# EAGLE design CBB-XBEE-r02_update (EAGLE 7.6.0)
DATABASE: ./../BOM/logic-supply-db.txt
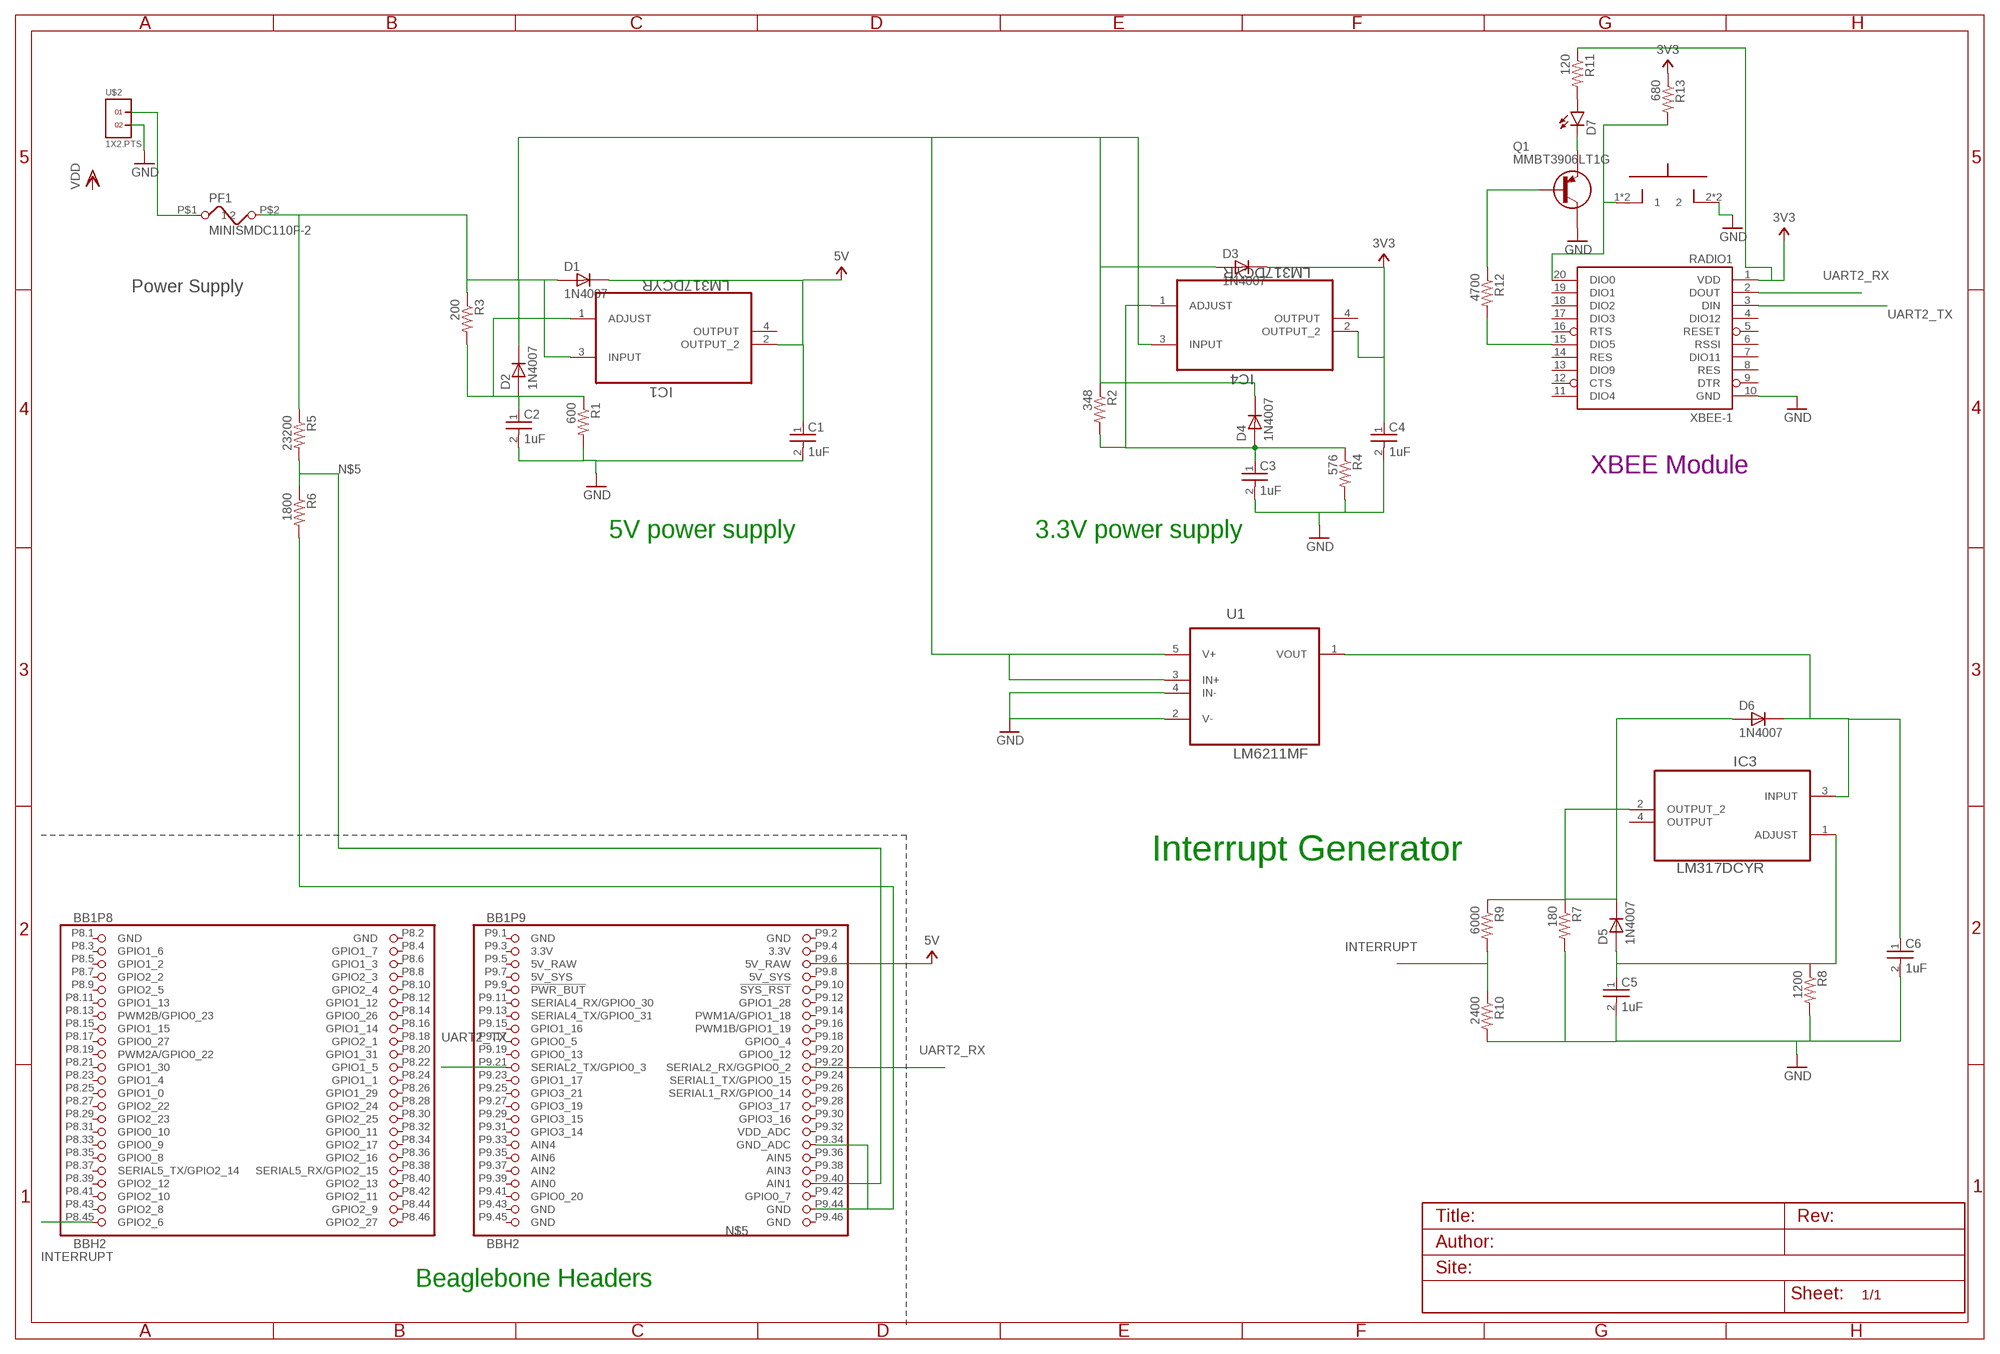
[diagram p0: schematic, sheet 1]

## Parts
BB1  BBH2  [BB_CAPE_TOP]
C1  1uF  GRM21BR71C105KA01L  [CAPC2012X135N]
C2  1uF  GRM21BR71C105KA01L  [CAPC2012X135N]
C3  1uF  GRM21BR71C105KA01L  [CAPC2012X135N]
C4  1uF  GRM21BR71C105KA01L  [CAPC2012X135N]
C5  1uF  GRM21BR71C105KA01L  [CAPC2012X135N]
C6  1uF  GRM21BR71C105KA01L  [CAPC2012X135N]
D1  1N4007  [DIOAD1070W78L465D235P]
D2  1N4007  [DIOAD1070W78L465D235P]
D3  1N4007  [DIOAD1070W78L465D235P]
D4  1N4007  [DIOAD1070W78L465D235P]
D5  1N4007  [DIOAD1070W78L465D235P]
D6  1N4007  [DIOAD1070W78L465D235P]
D7  LED3MM  [LED3MM]
IC1  LM317DCYR  [SOT230P700X180-4N]
IC3  LM317DCYR  [SOT230P700X180-4N]
IC4  LM317DCYR  [SOT230P700X180-4N]
PF1  MINISMDC110F-2  [MINISMDC110]
Q1  MMBT3906LT1G  [SOT23]
R1  600  RESISTOR0603  [0603-RES]
R2  348  RESISTOR0603  [0603-RES]
R3  200  RESISTOR0603  [0603-RES]
R4  576  RESISTOR0603  [0603-RES]
R5  23200  RESISTOR0603  [0603-RES]
R6  1800  RESISTOR0603  [0603-RES]
R7  180  RESISTOR0603  [0603-RES]
R8  1200  RESISTOR0603  [0603-RES]
R9  6000  RESISTOR0603  [0603-RES]
R10  2400  RESISTOR0603  [0603-RES]
R11  120  RESISTOR0603  [0603-RES]
R12  4700  RESISTOR0603  [0603-RES]
R13  680  RESISTOR0603  [0603-RES]
RADIO1  XBEE-1  [XBEE]
U1  LM6211MF  [SOT95P284X122-5N]
U$1  SPST-NOKS-01Q-01  [KS-01Q-01]
U$2  1X2.PTS  [PTS.FIXED]

## Nets
3V3: C4.1(A) D3.C IC4.2(OUTPUT_2) R11.1 R13.1 RADIO1.1(VDD)
5V: BB1.P9.6(P9:5V_RAW) C1.1(A) D1.C IC1.2(OUTPUT_2)
GND: C1.2(C) C2.2(C) C3.2(C) C4.2(C) C5.2(C) C6.2(C) Q1.3(C) R1.2 R4.2 R7.2 R8.2 R10.2 RADIO1.10(GND) U1.2(V-) U1.4(IN-) U$1.2 U$1.4 U$2.2
INTERRUPT: BB1.P8.45(P8:GPIO2_6) R9.2 R10.1
N$2: C3.1(A) D4.A IC4.1(ADJUST) R2.2 R4.1
N$3: D5.C D6.A IC3.2(OUTPUT_2) R7.1 R9.1
N$4: C2.1(A) D2.A IC1.1(ADJUST) R1.1 R3.2
N$5: BB1.P9.40(P9:AIN1) R5.2 R6.1
N$6: R12.2 RADIO1.15(DIO5)
N$7: D1.A D2.C D3.A D4.C IC1.3(INPUT) IC4.3(INPUT) PF1.P$2 R2.1 R3.1 R5.1 U1.3(IN+) U1.5(V+)
N$8: Q1.1(B) R12.1
N$9: C5.1(A) D5.A IC3.1(ADJUST) R8.1
N$10: C6.1(A) D6.C IC3.3(INPUT) U1.1(VOUT)
N$11: R13.2 RADIO1.20(DIO0) U$1.1 U$1.3
N$12: D7.A R11.2
N$13: D7.K(C) Q1.2(E)
N$14: PF1.P$1 U$2.1
N$33: BB1.P9.34(P9:GND_ADC) BB1.P9.44(P9:GND) R6.2
UART2_RX: BB1.P9.22(P9:SERIAL2_RX/GGPIO0_2) RADIO1.2(DOUT)
UART2_TX: BB1.P9.21(P9:SERIAL2_TX/GPIO0_3) RADIO1.3(DIN)
Unconnected: BB1.P8.3(P8:GPIO1_6) BB1.P8.4(P8:GPIO1_7) BB1.P8.5(P8:GPIO1_2) BB1.P8.6(P8:GPIO1_3) BB1.P8.7(P8:GPIO2_2) BB1.P8.8(P8:GPIO2_3) BB1.P8.9(P8:GPIO2_5) BB1.P8.10(P8:GPIO2_4) BB1.P8.11(P8:GPIO1_13) BB1.P8.12(P8:GPIO1_12) BB1.P8.13(P8:PWM2B/GPIO0_23) BB1.P8.14(P8:GPIO0_26) BB1.P8.15(P8:GPIO1_15) BB1.P8.16(P8:GPIO1_14) BB1.P8.17(P8:GPIO0_27) BB1.P8.18(P8:GPIO2_1) BB1.P8.19(P8:PWM2A/GPIO0_22) BB1.P8.20(P8:GPIO1_31) BB1.P8.21(P8:GPIO1_30) BB1.P8.22(P8:GPIO1_5) BB1.P8.23(P8:GPIO1_4) BB1.P8.24(P8:GPIO1_1) BB1.P8.25(P8:GPIO1_0) BB1.P8.26(P8:GPIO1_29) BB1.P8.27(P8:GPIO2_22) BB1.P8.28(P8:GPIO2_24) BB1.P8.29(P8:GPIO2_23) BB1.P8.30(P8:GPIO2_25) BB1.P8.31(P8:GPIO0_10) BB1.P8.32(P8:GPIO0_11) BB1.P8.33(P8:GPIO0_9) BB1.P8.34(P8:GPIO2_17) BB1.P8.35(P8:GPIO0_8) BB1.P8.36(P8:GPIO2_16) BB1.P8.37(P8:SERIAL5_TX/GPIO2_14) BB1.P8.38(P8:SERIAL5_RX/GPIO2_15) BB1.P8.39(P8:GPIO2_12) BB1.P8.40(P8:GPIO2_13) BB1.P8.41(P8:GPIO2_10) BB1.P8.42(P8:GPIO2_11) BB1.P8.43(P8:GPIO2_8) BB1.P8.44(P8:GPIO2_9) BB1.P8.46(P8:GPIO2_27) BB1.P9.9(P9:!PWR_BUT) BB1.P9.10(P9:!SYS_RST) BB1.P9.11(P9:SERIAL4_RX/GPIO0_30) BB1.P9.12(P9:GPIO1_28) BB1.P9.13(P9:SERIAL4_TX/GPIO0_31) BB1.P9.14(P9:PWM1A/GPIO1_18) BB1.P9.15(P9:GPIO1_16) BB1.P9.16(P9:PWM1B/GPIO1_19) BB1.P9.17(P9:GPIO0_5) BB1.P9.18(P9:GPIO0_4) BB1.P9.19(P9:GPIO0_13) BB1.P9.20(P9:GPIO0_12) BB1.P9.23(P9:GPIO1_17) BB1.P9.24(P9:SERIAL1_TX/GPIO0_15) BB1.P9.25(P9:GPIO3_21) BB1.P9.26(P9:SERIAL1_RX/GPIO0_14) BB1.P9.27(P9:GPIO3_19) BB1.P9.28(P9:GPIO3_17) BB1.P9.29(P9:GPIO3_15) BB1.P9.30(P9:GPIO3_16) BB1.P9.31(P9:GPIO3_14) BB1.P9.32(P9:VDD_ADC) BB1.P9.33(P9:AIN4) BB1.P9.35(P9:AIN6) BB1.P9.36(P9:AIN5) BB1.P9.37(P9:AIN2) BB1.P9.38(P9:AIN3) BB1.P9.39(P9:AIN0) BB1.P9.41(P9:GPIO0_20) BB1.P9.42(P9:GPIO0_7) BB1.P9.43(P9:GND) BB1.P9.45(P9:GND) BB1.P9.46(P9:GND) IC1.4(OUTPUT) IC3.4(OUTPUT) IC4.4(OUTPUT) RADIO1.4(DIO12) RADIO1.5(RESET) RADIO1.6(RSSI) RADIO1.7(DIO11) RADIO1.8(RES) RADIO1.9(DTR) RADIO1.11(DIO4) RADIO1.12(CTS) RADIO1.13(DIO9) RADIO1.14(RES) RADIO1.16(RTS) RADIO1.17(DIO3) RADIO1.18(DIO2) RADIO1.19(DIO1)

## Notes on the sheet
- Power Supply
- XBEE Module
- 5V power supply | 3.3V power supply
- Interrupt Generator
- Beaglebone Headers

## Power pins joined to a net without a drawn wire
3.3V: BB1.P9.3(P9:3.3V) BB1.P9.4(P9:3.3V)
5V_RAW: BB1.P9.5(P9:5V_RAW)
5V_SYS: BB1.P9.7(P9:5V_SYS) BB1.P9.8(P9:5V_SYS)
GND: BB1.P8.1(P8:GND) BB1.P8.2(P8:GND) BB1.P9.1(P9:GND) BB1.P9.2(P9:GND)

## Library data of the parts
BB1 = logic-supply:BBH: BeagleBone header sub-assembly BBH1 outdated, use BBH2 or BBH3 only
C1-C6 = GRM21BR71C105KA01L:GRM21BR71C105KA01L: 0805 1 uF 16 V ±10% Tolerance X7R SMT Multilayer Ceramic Capacitor
D1-D6 = 1N4007:1N4007
D7 = spark_led:LED: LEDs Standard schematic elements and footprints for 5mm, 3mm, 1206, and 0603 sized LEDs. 5mm - Spark Fun Electronics SKU : COM-00529 (and others); PROD_ID: DIO-08794
IC1 IC3 IC4 = LM317DCYR:LM317DCYR: IC ADJ LINEAR REG 1.25V TO 37V
PF1 = MINISMDC110F-2:MINISMDC110F-2
Q1 = MMBT3906LT1G:MMBT3906LT1G: http://octopart.com/mmbt3906lt1g.-on+semiconductor-8986246
R1-R13 = sparkres:RESISTOR: Resistor Basic schematic elements and footprints for 0603, 1206, and PTH resistors.
RADIO1 = logic-supply:XBEE-1: Xbee module footprint Derived from SparkFun-RF.lbr
U1 = LM6211MF:LM6211MF: Operational Amplifier
U$1 = firefly:SPST-NO
U$2 = terminal:1X2

## Board
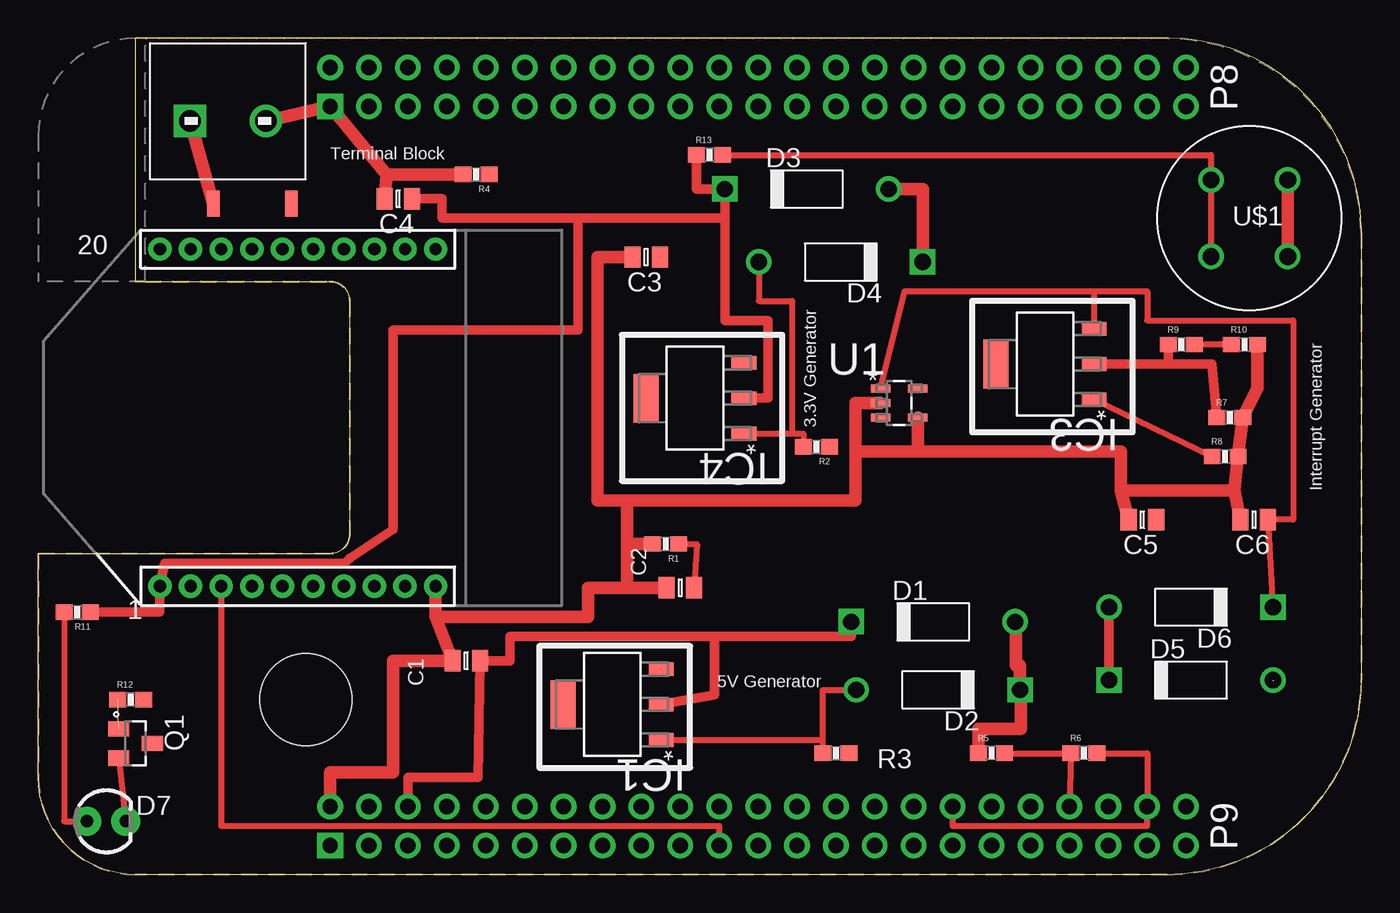
[diagram p1: board, top side]
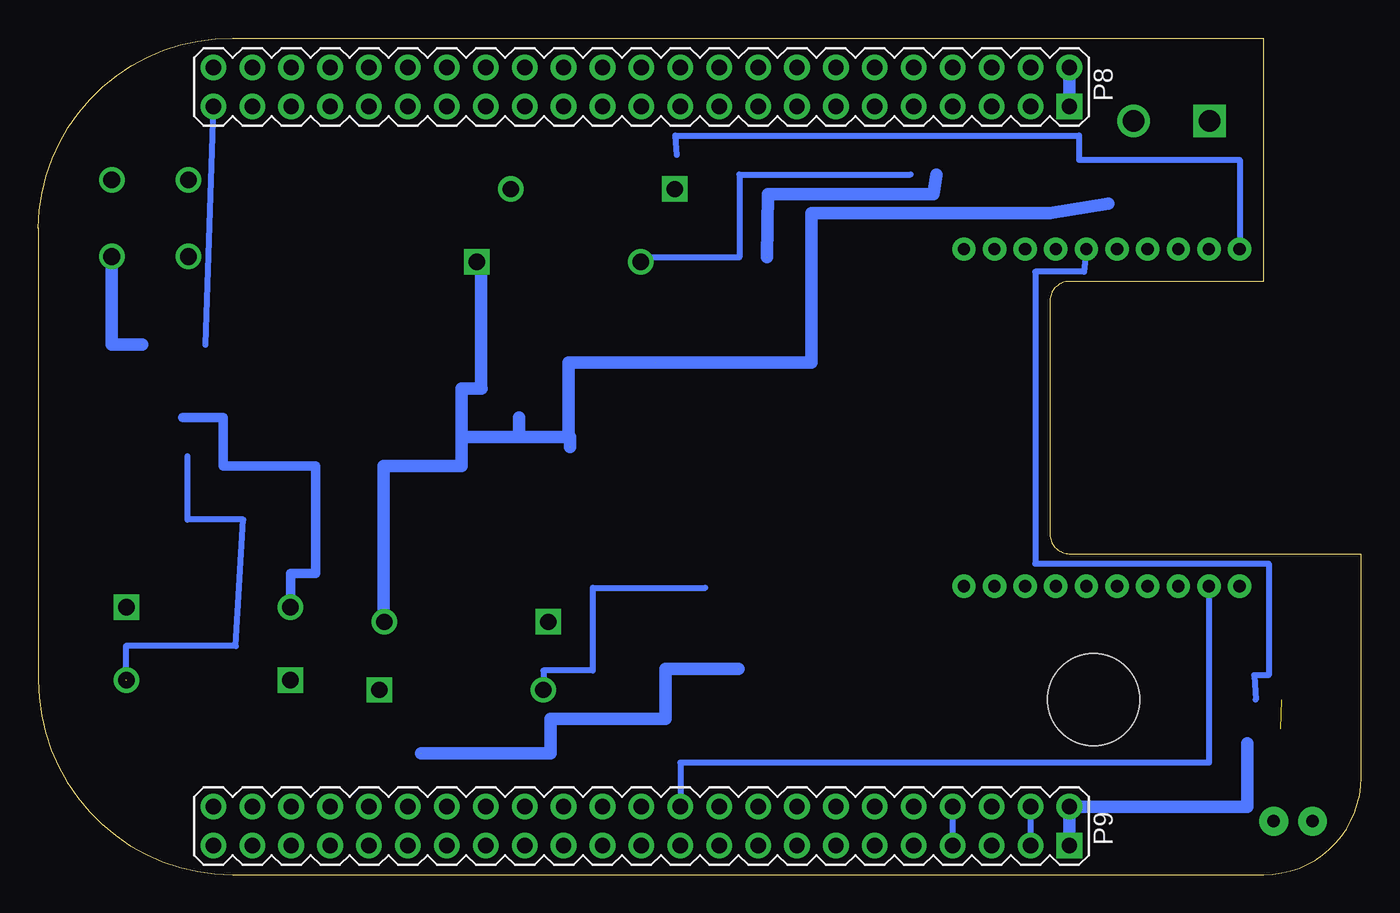
[diagram p2: board, bottom side, seen from below]

Size 86.36 x 54.61 mm. Coordinates in mm from the lower left corner, seen from the top.
Outline: 86.36,42.23 86.36,12.7 arc-90 73.66,0 6.35,0 arc-90 0,6.35 0,20.95 19.05,20.95 arc90 20.32,22.23 20.32,37.47 arc90 19.05,38.73 6.35,38.73 6.35,54.61 73.66,54.61 arc-90 86.36,42.23
Copper layers (1*16): Top 0.0356mm / dielectric 1.5011mm / Bottom 0.0356mm
Design rules "logicsupply": minimum track width 5mil, minimum drill 13mil, track to track 8mil, track to pad 8mil, pad to pad 8mil, via to via 8mil, smd to smd 8mil, copper to edge 10mil, drill to drill 6mil, minimum pad ring 7mil, minimum via ring 7mil, stop-mask expansion 4mil, vias tented up to drill 0mil, thermal gap 10mil
Holes 6 mm at 17.46,11.43

### Footprints (pad centres in the part's own frame; a part is rotated, then mirrored left to right if it is on the bottom)
BB_CAPE_TOP = drill 1 pad 1.676 square: P8.1 50.165,19.05; P9.1 1.905,19.05 | drill 1 pad 1.676: P8.2 52.705,19.05; P8.3 50.165,21.59; P8.4 52.705,21.59; P8.5 50.165,24.13; P8.6 52.705,24.13; P8.7 50.165,26.67; P8.8 52.705,26.67; P8.9 50.165,29.21; P8.10 52.705,29.21; P8.11 50.165,31.75; P8.12 52.705,31.75; P8.13 50.165,34.29; P8.14 52.705,34.29; P8.15 50.165,36.83; P8.16 52.705,36.83; P8.17 50.165,39.37; P8.18 52.705,39.37; P8.19 50.165,41.91; P8.20 52.705,41.91; P8.21 50.165,44.45; P8.22 52.705,44.45; P8.23 50.165,46.99; P8.24 52.705,46.99; P8.25 50.165,49.53; P8.26 52.705,49.53; P8.27 50.165,52.07; P8.28 52.705,52.07; P8.29 50.165,54.61; P8.30 52.705,54.61; P8.31 50.165,57.15; P8.32 52.705,57.15; P8.33 50.165,59.69; P8.34 52.705,59.69; P8.35 50.165,62.23; P8.36 52.705,62.23; P8.37 50.165,64.77; P8.38 52.705,64.77; P8.39 50.165,67.31; P8.40 52.705,67.31; P8.41 50.165,69.85; P8.42 52.705,69.85; P8.43 50.165,72.39; P8.44 52.705,72.39; P8.45 50.165,74.93; P8.46 52.705,74.93; P9.2 4.445,19.05; P9.3 1.905,21.59; P9.4 4.445,21.59; P9.5 1.905,24.13; P9.6 4.445,24.13; P9.7 1.905,26.67; P9.8 4.445,26.67; P9.9 1.905,29.21; P9.10 4.445,29.21; P9.11 1.905,31.75; P9.12 4.445,31.75; P9.13 1.905,34.29; P9.14 4.445,34.29; P9.15 1.905,36.83; P9.16 4.445,36.83; P9.17 1.905,39.37; P9.18 4.445,39.37; P9.19 1.905,41.91; P9.20 4.445,41.91; P9.21 1.905,44.45; P9.22 4.445,44.45; P9.23 1.905,46.99; P9.24 4.445,46.99; P9.25 1.905,49.53; P9.26 4.445,49.53; P9.27 1.905,52.07; P9.28 4.445,52.07; P9.29 1.905,54.61; P9.30 4.445,54.61; P9.31 1.905,57.15; P9.32 4.445,57.15; P9.33 1.905,59.69; P9.34 4.445,59.69; P9.35 1.905,62.23; P9.36 4.445,62.23; P9.37 1.905,64.77; P9.38 4.445,64.77; P9.39 1.905,67.31; P9.40 4.445,67.31; P9.41 1.905,69.85; P9.42 4.445,69.85; P9.43 1.905,72.39; P9.44 4.445,72.39; P9.45 1.905,74.93; P9.46 4.445,74.93
CAPC2012X135N = smd 1.05 x 1.4: 1 -0.9,0; 2 0.9,0
DIOAD1070W78L465D235P = drill 1.06 pad 1.66: A 5.35,0 | drill 1.06 pad 1.66 square: C -5.35,0
LED3MM = drill 0.813 pad 1.88: A -1.27,0; K 1.27,0
SOT230P700X180-4N = smd 1.626 x 0.889: 1 -3.2,2.311; 2 -3.2,0; 3 -3.2,-2.311 | smd 1.626 x 3.175: 4 3.2,0
MINISMDC110 = smd 0.813 x 1.676: P$1 -2.54,0; P$2 2.54,0
SOT23 = smd 1.4 x 1: 1 -1.1,0.95; 2 -1.1,-0.95; 3 1.1,0
0603-RES = smd 1.1 x 1: 1 -0.85,0; 2 0.85,0
XBEE = drill 0.8 pad 1.524: 1 -11,20; 2 -11,18; 3 -11,16; 4 -11,14; 5 -11,12; 6 -11,10; 7 -11,8; 8 -11,6; 9 -11,4; 10 -11,2; 11 11,2; 12 11,4; 13 11,6; 14 11,8; 15 11,10; 16 11,12; 17 11,14; 18 11,16; 19 11,18; 20 11,20
SOT95P284X122-5N = smd 1.27 x 0.533: 1 -1.219,0.94; 2 -1.219,0; 3 -1.219,-0.94; 4 1.219,-0.94; 5 1.219,0.94
KS-01Q-01 = drill 1.1: 1 -2.5,2.5; 2 2.5,2.5; 3 -2.5,-2.5; 4 2.5,-2.5
PTS.FIXED = drill 1.4 square: 1 -3.75,0 | drill 1.4: 2 1.21,0

### Placement (x,y rotation side)
BB1  0,0 90 bottom
C1  27.94,13.97 180 top
C2  41.91,18.73 180 top
C3  39.69,40.32 180 top
C4  23.5,44.13 180 top
C5  72.07,23.18 180 top
C6  79.38,23.18 180 top
D1  58.42,16.51 0 top
D2  58.74,12.06 180 top
D3  50.16,44.77 0 top
D4  52.39,40.01 180 top
D5  75.25,12.7 0 top
D6  75.25,17.46 180 top
D7  4.45,3.49 0 top
IC1  37.47,11.11 180 top
IC3  65.72,33.34 180 top
IC4  42.86,31.11 180 top
PF1  13.97,43.81 0 top
Q1  6.35,8.57 0 top
R1  40.96,21.59 180 top
R2  50.8,27.94 180 top
R3  52.07,7.94 180 top
R4  28.57,45.72 180 top
R5  62.23,7.94 0 top
R6  68.26,7.94 0 top
R7  77.79,29.84 0 top
R8  77.47,27.3 0 top
R9  74.61,34.61 0 top
R10  78.74,34.61 0 top
R11  2.54,17.14 180 top
R12  6.03,11.43 0 top
R13  43.81,46.99 0 top
RADIO1  27.94,29.84 90 top
U1  56.2,30.8 0 top
U$1  79.06,42.86 0 top
U$2  13.65,49.21 0 top

### Tracks (layer width: path | path; a pad name or v marks a point on that pad's centre or on a via)
3.3V
  Bottom 0.406: BB1.P9.4 BB1.P9.3
3V3
  Top 0.406: 44.81,36.2 44.77,36.2
  Top 0.61: 35.24,42.86 26.35,42.86 26.35,44.13 C4.1 | IC4.2 47.62,31.11 47.62,36.2 44.81,36.2 44.81,42.86 | 44.81,42.86 D3.C 42.97,44.77 R13.1 | 35.24,42.86 35.24,35.56 23.18,35.56 23.18,22.54 20.32,20.64 20,20.32 8.26,20.32 RADIO1.1 7.94,17.14 R11.1 | 35.24,42.86 44.81,42.86
5V
  Top 0.61: 44.13,15.56 30.8,15.56 30.8,13.97 C1.1 28.7,6.35 24.13,6.35 BB1.P9.6 | 44.13,15.56 44.13,11.75 IC1.2 | D1.C 53.07,15.56 44.13,15.56
5V_SYS
  Bottom 0.406: BB1.P9.8 BB1.P9.7
GND  (4 unrouted)
  Top 0.406: 35.88,16.83 | 40.32,18.73 C2.2
  Top 0.813: RADIO1.10 25.92,16.83 | 25.92,16.83 C1.2 23.18,13.97 23.18,6.67 19.05,6.67 BB1.P9.2 | C2.2 38.42,18.73 | R1.2 38.42,21.59 | 38.42,21.59 38.42,18.73 | C4.2 22.73,45.72 | U1.2 53.34,30.8 53.34,27.62 | 53.34,27.62 53.34,24.45 38.42,24.45 | 38.42,24.45 38.42,21.59 | C3.2 36.51,40.32 36.51,24.45 38.42,24.45 | R10.2 79.59,31.75 R7.2 R8.2 78.09,25.08 | 78.09,25.08 C6.2 | C5.2 70.67,25.08 | 70.67,25.08 78.09,25.08 | U1.4 57.42,27.62 | 57.42,27.62 53.34,27.62 | 70.67,25.08 70.67,27.62 57.42,27.62 | 22.73,45.72 R4.2 | 25.92,16.83 35.88,16.83 35.88,18.73 38.42,18.73 | U$1.2 U$1.4 | 22.73,45.72 BB1.P8.1 U$2.2
  Bottom 0.813: BB1.P9.1 BB1.P9.2 7.45,4.45 Q1.3 | C3.2 38.73,44.45 27.94,44.45 R4.2 | U$1.4 81.56,34.61 R10.2 | BB1.P8.1 BB1.P8.2
INTERRUPT  (1 unrouted)
  Top 0.406: R10.1 R9.2
  Bottom 0.406: BB1.P8.45 R9.2
N$2  (2 unrouted)
  Top 0.406: IC4.1 49.21,28.8 | 49.21,28.8 49.95,28.8 R2.2 | D4.A 47.04,37.47 49.21,37.47 49.21,28.8
  Bottom 0.406: R4.1 40.59,45.72 C3.1 47.04,40.32 D4.A
N$3  (1 unrouted)
  Top 0.61: D6.A D5.C | R9.1 73.76,33.34 | 73.76,33.34 IC3.2 | 73.76,33.34 76.62,33.34 R7.1
  Bottom 0.61: D6.A 69.9,19.68 68.26,19.68 68.26,26.67 74.3,26.67 74.3,29.84 R7.1
N$4  (2 unrouted)
  Top 0.406: R1.1 42.99,21.59 C2.1 | R3.2 51.22,8.8 | 51.22,8.8 51.22,12.06 D2.A | IC1.1 51.22,8.8
  Bottom 0.406: D2.A 53.39,13.34 50.16,13.34 50.16,18.73 C2.1
N$5
  Top 0.406: R5.2 R6.1 BB1.P9.40
N$6  (1 unrouted)
  Bottom 0.406: RADIO1.15 18.1,39.37 21.27,39.37 21.27,20.32 6.03,20.32 6.03,13.02 6.99,13.02 R12.2
N$7  (8 unrouted)
  Top 0.406: 64.14,12.06 D2.C | 46.06,33.34 IC4.3 | 64.09,13.65 63.82,13.65 | 63.82,16.51 D1.A
  Top 0.813: R5.1 61.38,9.53 64.14,9.53 64.14,12.06 | D3.A 57.74,44.77 D4.C | D2.C 64.09,13.65 | 63.82,13.65 63.82,16.51
  Bottom 0.406: 46.06,33.34 IC4.3 | 51.75,28.57 51.65,28.57 | 51.65,33.43 51.75,33.43 | U1.5 57.47,31.74 | 63.82,16.51 D1.A
  Bottom 0.813: 51.65,28.57 R2.1 | 58.74,28.57 58.74,31.74 U1.5 | 58.74,28.57 54.98,28.57 | 54.98,28.57 U1.3 | 51.65,33.43 IC4.3 35.88,33.43 35.88,43.18 20.32,43.18 PF1.P$2 | 54.98,28.57 51.75,28.57 51.75,33.43 | 57.47,31.74 57.47,40.01 D4.C | 58.74,28.57 58.74,26.67 63.82,26.67 63.82,16.51 | R5.1 R3.1 52.92,10.16 45.4,10.16 45.4,13.42 IC1.3
N$8  (1 unrouted)
N$9  (3 unrouted)
  Top 0.406: IC3.1 R8.1
  Bottom 0.406: 80.64,12.7 80.64,14.92 73.47,14.92 C5.1 76.62,23.18 R8.1
N$10
  Top 0.406: D6.C C6.1 81.92,23.18 81.92,36.2 72.39,36.2 72.39,38.1 68.9,38.1 | 68.9,38.1 68.9,35.65 IC3.3 | U1.1 56.57,38.1 68.9,38.1
N$11
  Top 0.406: U$1.3 U$1.1 76.56,46.99 R13.2
  Bottom 0.406: R13.2 44.77,48.26 18.41,48.26 18.41,46.67 7.94,46.67 RADIO1.20
N$12
  Top 0.406: R11.2 1.69,3.49 D7.A
N$13
  Top 0.406: Q1.2 D7.K
N$14
  Top 0.813: U$2.1 PF1.P$1
N$33
  Top 0.406: R6.2 72.39,7.94 BB1.P9.44 72.39,3.17 59.69,3.17 BB1.P9.34
UART2_RX
  Bottom 0.406: RADIO1.2 9.94,7.3 44.45,7.3 BB1.P9.22
UART2_TX
  Top 0.406: RADIO1.3 11.94,3.17 44.45,3.17 BB1.P9.21

### Text on the board
tPlace: P8 | Terminal Block | 20 | 3.3V Generator | Interrupt Generator | 1 | 5V Generator | P9